# Altium schematic sheet PowerLegs.SchDoc: Title
size 594 x 420 mm; CompanyName: Лаборатория беспилотных систем; Address1: Address1; Address2: Address2; Address3: Address3; Address4: Address4; DocumentNumber: АБВГ.123456.001 Э3; SheetNumber: 2; SheetTotal: 2; Scale: -; DocumentType: Схема электрическая принципиальная; FirstReferrence: АБВГ.123456.001
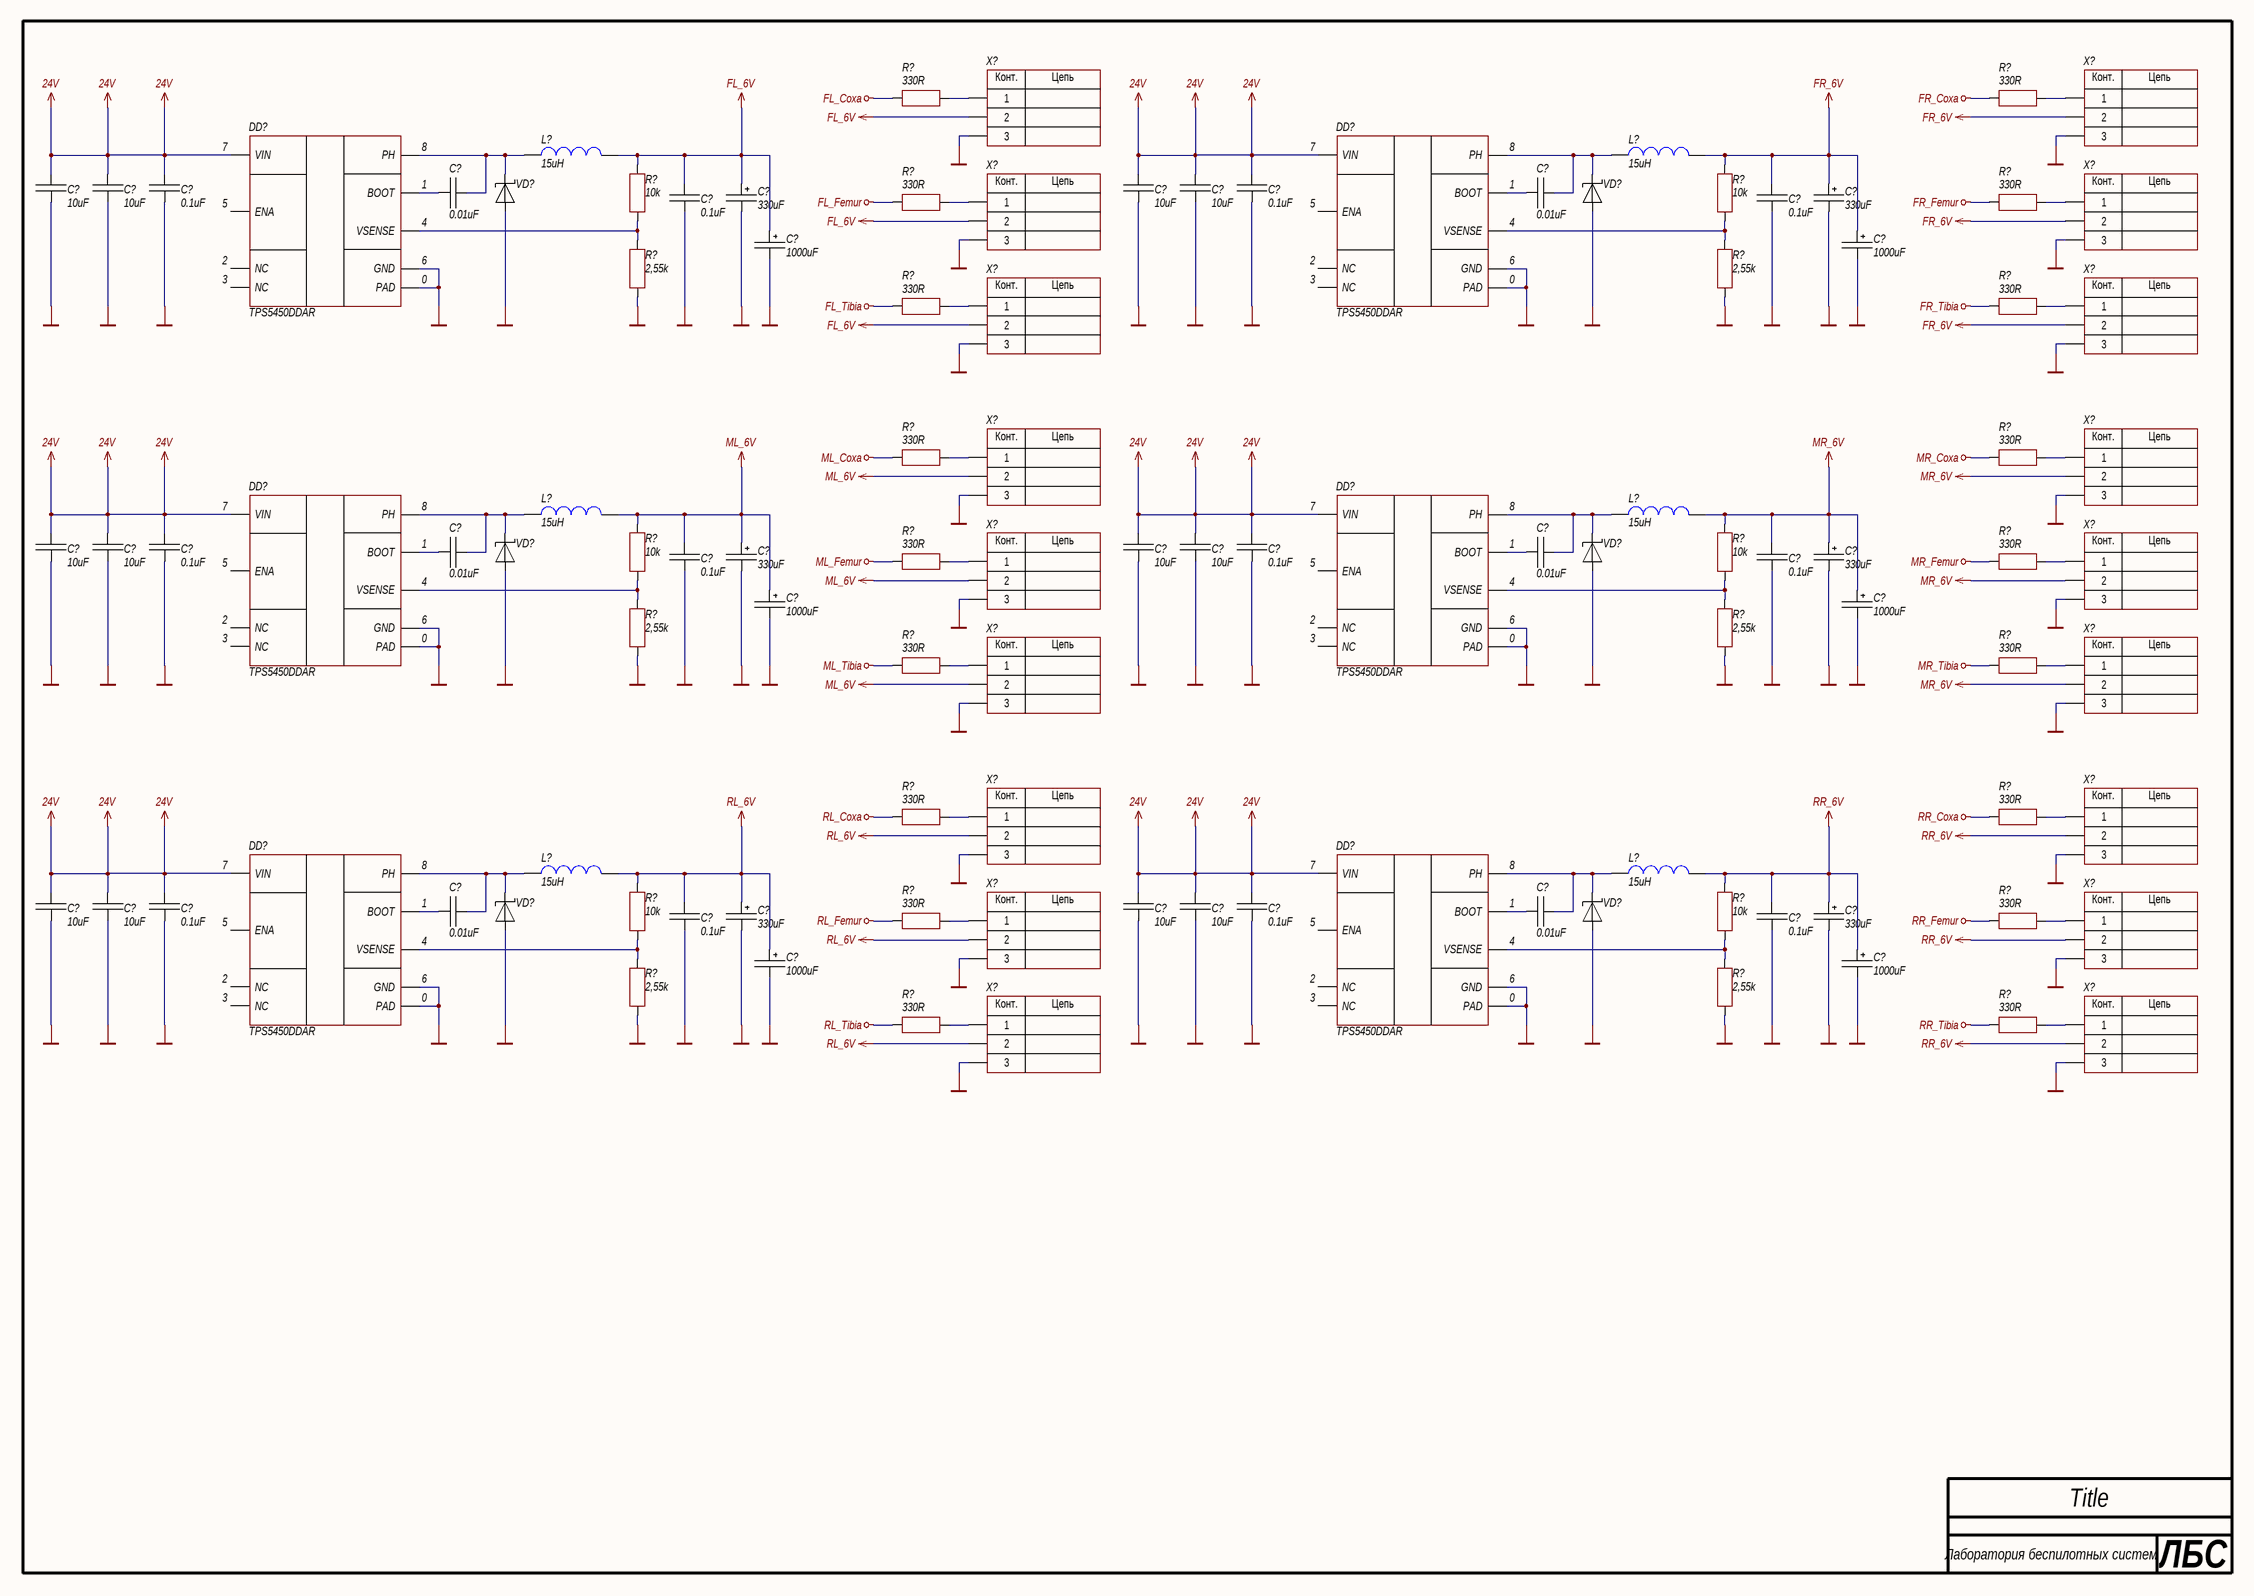
[diagram p0: PowerLegs.SchDoc]

## Parts
(Parts that share a designator on the sheet are numbered #1, #2 ... from top to bottom, then left to right.)
C?#1  value 10uF  [CAP: 1206]
C?#2  value 10uF  [CAP: 1206]
C?#3  value 0.1uF  [CAP: 0603]
C?#4  value 10uF  [CAP: 1206]
C?#5  value 10uF  [CAP: 1206]
C?#6  value 0.1uF  [CAP: 0603]
C?#7  value 330uF  [CAP: SMD_L7.3-W4.3-H1.9]
C?#8  value 330uF  [CAP: SMD_L7.3-W4.3-H1.9]
C?#9  value 0.01uF  [CAP: 0603]
C?#10  value 0.01uF  [CAP: 0603]
C?#11  value 0.1uF  [CAP: 0603]
C?#12  value 0.1uF  [CAP: 0603]
C?#13  value 1000uF  [CAP: SMD_L7.3-W4.3-H1.9]
C?#14  value 1000uF  [CAP: SMD_L7.3-W4.3-H1.9]
C?#15  value 10uF  [CAP: 1206]
C?#16  value 10uF  [CAP: 1206]
C?#17  value 0.1uF  [CAP: 0603]
C?#18  value 10uF  [CAP: 1206]
C?#19  value 10uF  [CAP: 1206]
C?#20  value 0.1uF  [CAP: 0603]
C?#21  value 330uF  [CAP: SMD_L7.3-W4.3-H1.9]
C?#22  value 330uF  [CAP: SMD_L7.3-W4.3-H1.9]
C?#23  value 0.01uF  [CAP: 0603]
C?#24  value 0.01uF  [CAP: 0603]
C?#25  value 0.1uF  [CAP: 0603]
C?#26  value 0.1uF  [CAP: 0603]
C?#27  value 1000uF  [CAP: SMD_L7.3-W4.3-H1.9]
C?#28  value 1000uF  [CAP: SMD_L7.3-W4.3-H1.9]
C?#29  value 10uF  [CAP: 1206]
C?#30  value 10uF  [CAP: 1206]
C?#31  value 0.1uF  [CAP: 0603]
C?#32  value 10uF  [CAP: 1206]
C?#33  value 10uF  [CAP: 1206]
C?#34  value 0.1uF  [CAP: 0603]
C?#35  value 330uF  [CAP: SMD_L7.3-W4.3-H1.9]
C?#36  value 330uF  [CAP: SMD_L7.3-W4.3-H1.9]
C?#37  value 0.01uF  [CAP: 0603]
C?#38  value 0.01uF  [CAP: 0603]
C?#39  value 0.1uF  [CAP: 0603]
C?#40  value 0.1uF  [CAP: 0603]
C?#41  value 1000uF  [CAP: SMD_L7.3-W4.3-H1.9]
C?#42  value 1000uF  [CAP: SMD_L7.3-W4.3-H1.9]
DD?#1  TPS5450DDAR
DD?#2  TPS5450DDAR
DD?#3  TPS5450DDAR
DD?#4  TPS5450DDAR
DD?#5  TPS5450DDAR
DD?#6  TPS5450DDAR
L?#1  value 15uH  [IND: SMD_L2.5-W2.0]
L?#2  value 15uH  [IND: SMD_L2.5-W2.0]
L?#3  value 15uH  [IND: SMD_L2.5-W2.0]
L?#4  value 15uH  [IND: SMD_L2.5-W2.0]
L?#5  value 15uH  [IND: SMD_L2.5-W2.0]
L?#6  value 15uH  [IND: SMD_L2.5-W2.0]
R?#1  value 330R  [RES: 0603]
R?#2  value 330R  [RES: 0603]
R?#3  value 330R  [RES: 0603]
R?#4  value 330R  [RES: 0603]
R?#5  value 10k  [RES: 0603]
R?#6  value 10k  [RES: 0603]
R?#7  value 2,55k  [RES: 0603]
R?#8  value 2,55k  [RES: 0603]
R?#9  value 330R  [RES: 0603]
R?#10  value 330R  [RES: 0603]
R?#11  value 330R  [RES: 0603]
R?#12  value 330R  [RES: 0603]
R?#13  value 330R  [RES: 0603]
R?#14  value 330R  [RES: 0603]
R?#15  value 10k  [RES: 0603]
R?#16  value 10k  [RES: 0603]
R?#17  value 2,55k  [RES: 0603]
R?#18  value 2,55k  [RES: 0603]
R?#19  value 330R  [RES: 0603]
R?#20  value 330R  [RES: 0603]
R?#21  value 330R  [RES: 0603]
R?#22  value 330R  [RES: 0603]
R?#23  value 330R  [RES: 0603]
R?#24  value 330R  [RES: 0603]
R?#25  value 10k  [RES: 0603]
R?#26  value 10k  [RES: 0603]
R?#27  value 2,55k  [RES: 0603]
R?#28  value 2,55k  [RES: 0603]
R?#29  value 330R  [RES: 0603]
R?#30  value 330R  [RES: 0603]
VD?#1  (no value)  [DIODE: SMA]
VD?#2  (no value)  [DIODE: SMA]
VD?#3  (no value)  [DIODE: SMA]
VD?#4  (no value)  [DIODE: SMA]
VD?#5  (no value)  [DIODE: SMA]
VD?#6  (no value)  [DIODE: SMA]
X?#1  (no value)  [CON: PLS-3]
X?#2  (no value)  [CON: PLS-3]
X?#3  (no value)  [CON: PLS-3]
X?#4  (no value)  [CON: PLS-3]
X?#5  (no value)  [CON: PLS-3]
X?#6  (no value)  [CON: PLS-3]
X?#7  (no value)  [CON: PLS-3]
X?#8  (no value)  [CON: PLS-3]
X?#9  (no value)  [CON: PLS-3]
X?#10  (no value)  [CON: PLS-3]
X?#11  (no value)  [CON: PLS-3]
X?#12  (no value)  [CON: PLS-3]
X?#13  (no value)  [CON: PLS-3]
X?#14  (no value)  [CON: PLS-3]
X?#15  (no value)  [CON: PLS-3]
X?#16  (no value)  [CON: PLS-3]
X?#17  (no value)  [CON: PLS-3]
X?#18  (no value)  [CON: PLS-3]

## Nets
24V: C?#1.2 C?#2.2 C?#3.2 C?#4.2 C?#5.2 C?#6.2 C?#15.2 C?#16.2 C?#17.2 C?#18.2 C?#19.2 C?#20.2 C?#29.2 C?#30.2 C?#31.2 C?#32.2 C?#33.2 C?#34.2 DD?#1.7(VIN) DD?#2.7(VIN) DD?#3.7(VIN) DD?#4.7(VIN) DD?#5.7(VIN) DD?#6.7(VIN)
FL_6V: C?#7.1 C?#11.1 C?#13.1 L?#1.1 R?#5.2 X?#1.2 X?#3.2 X?#5.2
FL_Coxa: R?#1.1
FL_Femur: R?#3.1
FL_Tibia: R?#9.1
FR_6V: C?#8.1 C?#12.1 C?#14.1 L?#2.1 R?#6.2 X?#2.2 X?#4.2 X?#6.2
FR_Coxa: R?#2.1
FR_Femur: R?#4.1
FR_Tibia: R?#10.1
GND: C?#1.1 C?#2.1 C?#3.1 C?#4.1 C?#5.1 C?#6.1 C?#7.2 C?#8.2 C?#11.2 C?#12.2 C?#13.2 C?#14.2 C?#15.1 C?#16.1 C?#17.1 C?#18.1 C?#19.1 C?#20.1 C?#21.2 C?#22.2 C?#25.2 C?#26.2 C?#27.2 C?#28.2 C?#29.1 C?#30.1 C?#31.1 C?#32.1 C?#33.1 C?#34.1 C?#35.2 C?#36.2 C?#39.2 C?#40.2 C?#41.2 C?#42.2 DD?#1.0(PAD) DD?#1.6(GND) DD?#2.0(PAD) DD?#2.6(GND) DD?#3.0(PAD) DD?#3.6(GND) DD?#4.0(PAD) DD?#4.6(GND) DD?#5.0(PAD) DD?#5.6(GND) DD?#6.0(PAD) DD?#6.6(GND) R?#7.1 R?#8.1 R?#17.1 R?#18.1 R?#27.1 R?#28.1 VD?#1.1 VD?#2.1 VD?#3.1 VD?#4.1 VD?#5.1 VD?#6.1 X?#1.3 X?#2.3 X?#3.3 X?#4.3 X?#5.3 X?#6.3 X?#7.3 X?#8.3 X?#9.3 X?#10.3 X?#11.3 X?#12.3 X?#13.3 X?#14.3 X?#15.3 X?#16.3 X?#17.3 X?#18.3
ML_6V: C?#21.1 C?#25.1 C?#27.1 L?#3.1 R?#15.2 X?#7.2 X?#9.2 X?#11.2
ML_Coxa: R?#11.1
ML_Femur: R?#13.1
ML_Tibia: R?#19.1
MR_6V: C?#22.1 C?#26.1 C?#28.1 L?#4.1 R?#16.2 X?#8.2 X?#10.2 X?#12.2
MR_Coxa: R?#12.1
MR_Femur: R?#14.1
MR_Tibia: R?#20.1
RL_6V: C?#35.1 C?#39.1 C?#41.1 L?#5.1 R?#25.2 X?#13.2 X?#15.2 X?#17.2
RL_Coxa: R?#21.1
RL_Femur: R?#23.1
RL_Tibia: R?#29.1
RR_6V: C?#36.1 C?#40.1 C?#42.1 L?#6.1 R?#26.2 X?#14.2 X?#16.2 X?#18.2
RR_Coxa: R?#22.1
RR_Femur: R?#24.1
RR_Tibia: R?#30.1
NetC?#9_1: C?#9.1 DD?#1.8(PH) L?#1.2 VD?#1.2
NetC?#9_2: C?#9.2 DD?#1.1(BOOT)
NetC?#10_1: C?#10.1 DD?#2.8(PH) L?#2.2 VD?#2.2
NetC?#10_2: C?#10.2 DD?#2.1(BOOT)
NetC?#23_1: C?#23.1 DD?#3.8(PH) L?#3.2 VD?#3.2
NetC?#23_2: C?#23.2 DD?#3.1(BOOT)
NetC?#24_1: C?#24.1 DD?#4.8(PH) L?#4.2 VD?#4.2
NetC?#24_2: C?#24.2 DD?#4.1(BOOT)
NetC?#37_1: C?#37.1 DD?#5.8(PH) L?#5.2 VD?#5.2
NetC?#37_2: C?#37.2 DD?#5.1(BOOT)
NetC?#38_1: C?#38.1 DD?#6.8(PH) L?#6.2 VD?#6.2
NetC?#38_2: C?#38.2 DD?#6.1(BOOT)
NetDD?#1_4: DD?#1.4(VSENSE) R?#5.1 R?#7.2
NetDD?#2_4: DD?#2.4(VSENSE) R?#6.1 R?#8.2
NetDD?#3_4: DD?#3.4(VSENSE) R?#15.1 R?#17.2
NetDD?#4_4: DD?#4.4(VSENSE) R?#16.1 R?#18.2
NetDD?#5_4: DD?#5.4(VSENSE) R?#25.1 R?#27.2
NetDD?#6_4: DD?#6.4(VSENSE) R?#26.1 R?#28.2
NetR?#1_2: R?#1.2 X?#1.1
NetR?#2_2: R?#2.2 X?#2.1
NetR?#3_2: R?#3.2 X?#3.1
NetR?#4_2: R?#4.2 X?#4.1
NetR?#9_2: R?#9.2 X?#5.1
NetR?#10_2: R?#10.2 X?#6.1
NetR?#11_2: R?#11.2 X?#7.1
NetR?#12_2: R?#12.2 X?#8.1
NetR?#13_2: R?#13.2 X?#9.1
NetR?#14_2: R?#14.2 X?#10.1
NetR?#19_2: R?#19.2 X?#11.1
NetR?#20_2: R?#20.2 X?#12.1
NetR?#21_2: R?#21.2 X?#13.1
NetR?#22_2: R?#22.2 X?#14.1
NetR?#23_2: R?#23.2 X?#15.1
NetR?#24_2: R?#24.2 X?#16.1
NetR?#29_2: R?#29.2 X?#17.1
NetR?#30_2: R?#30.2 X?#18.1

Not connected (* = marked no-connect by the designer): DD?#1 2(NC) 3(NC) 5(ENA); DD?#2 2(NC) 3(NC) 5(ENA); DD?#3 2(NC) 3(NC) 5(ENA); DD?#4 2(NC) 3(NC) 5(ENA); DD?#5 2(NC) 3(NC) 5(ENA); DD?#6 2(NC) 3(NC) 5(ENA)

## Notes on the sheet
- ЛБС
- (in symbol PLS-3) Конт.; Цепь

## Library data of the parts
C?#1 C?#2 C?#4 C?#5 C?#15 C?#16 C?#18 C?#19 C?#29 C?#30 C?#32 C?#33 = Ceramic_1206: Manufacturer: Yageo; PartNumber: CC1206KRX7R9BB104; ValueManufacturerPartNumber: Ceramic capacitor, 10uF, X7R, ±10%, 50V, 1206, -55...+125°C; TypeCapacitor: Ceramic capacitor; Tolerance: ±10%; TypeDielectric: X7R; Voltage: 50V; Package: 1206; HelpURL: https://www.digikey.com/product-detail/en/yageo/CC1206KRX7R9BB104/311-1179-1-ND/303089; Temperature: -55...+125°C
C?#3 C?#6 C?#11 C?#12 C?#17 C?#20 C?#25 C?#26 C?#31 C?#34 C?#39 C?#40 = Ceramic_0603: Manufacturer: Yageo; PartNumber: CC0603KRX7R7BB104; ValueManufacturerPartNumber: Ceramic capacitor, 0.1uF, X7R, ±10%, 16V, 0603, -55...+125°C; TypeCapacitor: Ceramic capacitor; Tolerance: ±10%; TypeDielectric: X7R; Voltage: 16V; Package: 0603; HelpURL: https://www.digikey.com/product-detail/en/yageo/CC0603KRX7R7BB104/311-1088-1-ND/302998; Temperature: -55...+125°C
C?#7 C?#8 C?#21 C?#22 C?#35 C?#36 = Polymer_7.3x4.3x1.9: Manufacturer: Ymin; PartNumber: MPD220M1VD19040R; ValueManufacturerPartNumber: Polymer Cap, 330uF, 35V, ±20%, 40mOhm@100kHz, SMD,7.3x4.3х1.9mm, -55...+125°C; Impedance: 40mOhm@100kHz; Tolerance: ±20%; TypeCapacitor: Polymer Cap; Voltage: 35V; Package: SMD,7.3x4.3х1.9mm; HelpURL: https://jlcpcb.com/partdetail/Ymin-MPD220M1VD19040R/C2997487; Temperature: -55...+125°C; TypeDielectric: Polymer; SupplierCode: C2997487
C?#9 C?#10 C?#23 C?#24 C?#37 C?#38 = Ceramic_0603: Manufacturer: Yageo; PartNumber: CC0603KRX7R7BB104; ValueManufacturerPartNumber: Ceramic capacitor, 0.01uF, X7R, ±10%, 16V, 0603, -55...+125°C; TypeCapacitor: Ceramic capacitor; Tolerance: ±10%; TypeDielectric: X7R; Voltage: 16V; Package: 0603; HelpURL: https://www.digikey.com/product-detail/en/yageo/CC0603KRX7R7BB104/311-1088-1-ND/302998; Temperature: -55...+125°C
C?#13 C?#14 C?#27 C?#28 C?#41 C?#42 = Polymer_7.3x4.3x1.9: Manufacturer: Ymin; PartNumber: MPD220M1VD19040R; ValueManufacturerPartNumber: Polymer Cap, 1000uF, 35V, ±20%, 40mOhm@100kHz, SMD,7.3x4.3х1.9mm, -55...+125°C; Impedance: 40mOhm@100kHz; Tolerance: ±20%; TypeCapacitor: Polymer Cap; Voltage: 35V; Package: SMD,7.3x4.3х1.9mm; HelpURL: https://jlcpcb.com/partdetail/Ymin-MPD220M1VD19040R/C2997487; Temperature: -55...+125°C; TypeDielectric: Polymer; SupplierCode: C2997487
L?#1-L?#6 = Inductor_FTC252010S220MBCA: Manufacturer: Sunlord; TypeInductor: Fixed inductor; MaxCurrent: 1.1A; Tolerance: ±20%; PartNumber: FTC252010S220MBCA; Package: SMD,2x2.5mm; HelpURL: https://jlcpcb.com/partdetail/6763511-FTC252010S220MBCA/C5832391; ValueManufacturerPartNumber: =TypeInductor+', '+Value+', '+Tolerance+', '+Package+', '+MaxCurrent+', '+Temperature; SupplierCode: C5832391
R?#1-R?#4 R?#9-R?#14 R?#19-R?#24 R?#29 R?#30 = Resistor_0603: Manufacturer: Yageo; PartNumber: RC0603JR-07100RL; ValueManufacturerPartNumber: Resistor film, 330R, ±5%, 0603, 0.1W, -55...+125°C; TypeResistor: Resistor film; Power: 0.1W; Tolerance: ±5%; Package: 0603; HelpURL: https://www.digikey.com/product-detail/en/yageo/RC0603JR-07100RL/311-100GRCT-ND/729644; Temperature: -55...+125°C
R?#5 R?#6 R?#15 R?#16 R?#25 R?#26 = Resistor_0603: Manufacturer: Yageo; PartNumber: RC0603JR-07100RL; ValueManufacturerPartNumber: Resistor film, 10k, ±5%, 0603, 0.1W, -55...+125°C; TypeResistor: Resistor film; Power: 0.1W; Tolerance: ±5%; Package: 0603; HelpURL: https://www.digikey.com/product-detail/en/yageo/RC0603JR-07100RL/311-100GRCT-ND/729644; Temperature: -55...+125°C
R?#7 R?#8 R?#17 R?#18 R?#27 R?#28 = Resistor_0603: Manufacturer: Yageo; PartNumber: RC0603JR-07100RL; ValueManufacturerPartNumber: Resistor film, 2,55k, ±5%, 0603, 0.1W, -55...+125°C; TypeResistor: Resistor film; Power: 0.1W; Tolerance: ±5%; Package: 0603; HelpURL: https://www.digikey.com/product-detail/en/yageo/RC0603JR-07100RL/311-100GRCT-ND/729644; Temperature: -55...+125°C
VD?#1-VD?#6 = Schottky_single: Manufacturer: Diodes Incorporated; ValueManufacturerPartNumber: Schottky diode, 80V, 500mA, 1V, 15pF, SOD-123, -55...+150°C; PartNumber: MBR0580S1-7; TypeDiode: Schottky diode; Voltage: 80V; Current: 500mA; VoltageDrop: 1V; RecoveryTime: 15pF; Package: SOD-123; HelpURL: https://www.digikey.com/product-detail/en/diodes-incorporated/MBR0580S1-7/MBR0580S1-7DICT-ND/5080371; Temperature: -55...+150°C
X?#1-X?#18 = PLS-3: Manufacturer: Connfly; ValueManufacturerPartNumber: Connector, 3pin, 2.54mm, 500VAC, 3A; TypeConnector: Connector; Voltage: 500VAC; Pitch: 2.54mm; Current: 3A; Multichannel: 3pin; HelpURL: https://www.chipdip.ru/product/pls-3; PartNumber: PLS-3